# Altium schematic sheet MCU_power.SchDoc
size A4; SheetNumber: 5; SheetTotal: 5
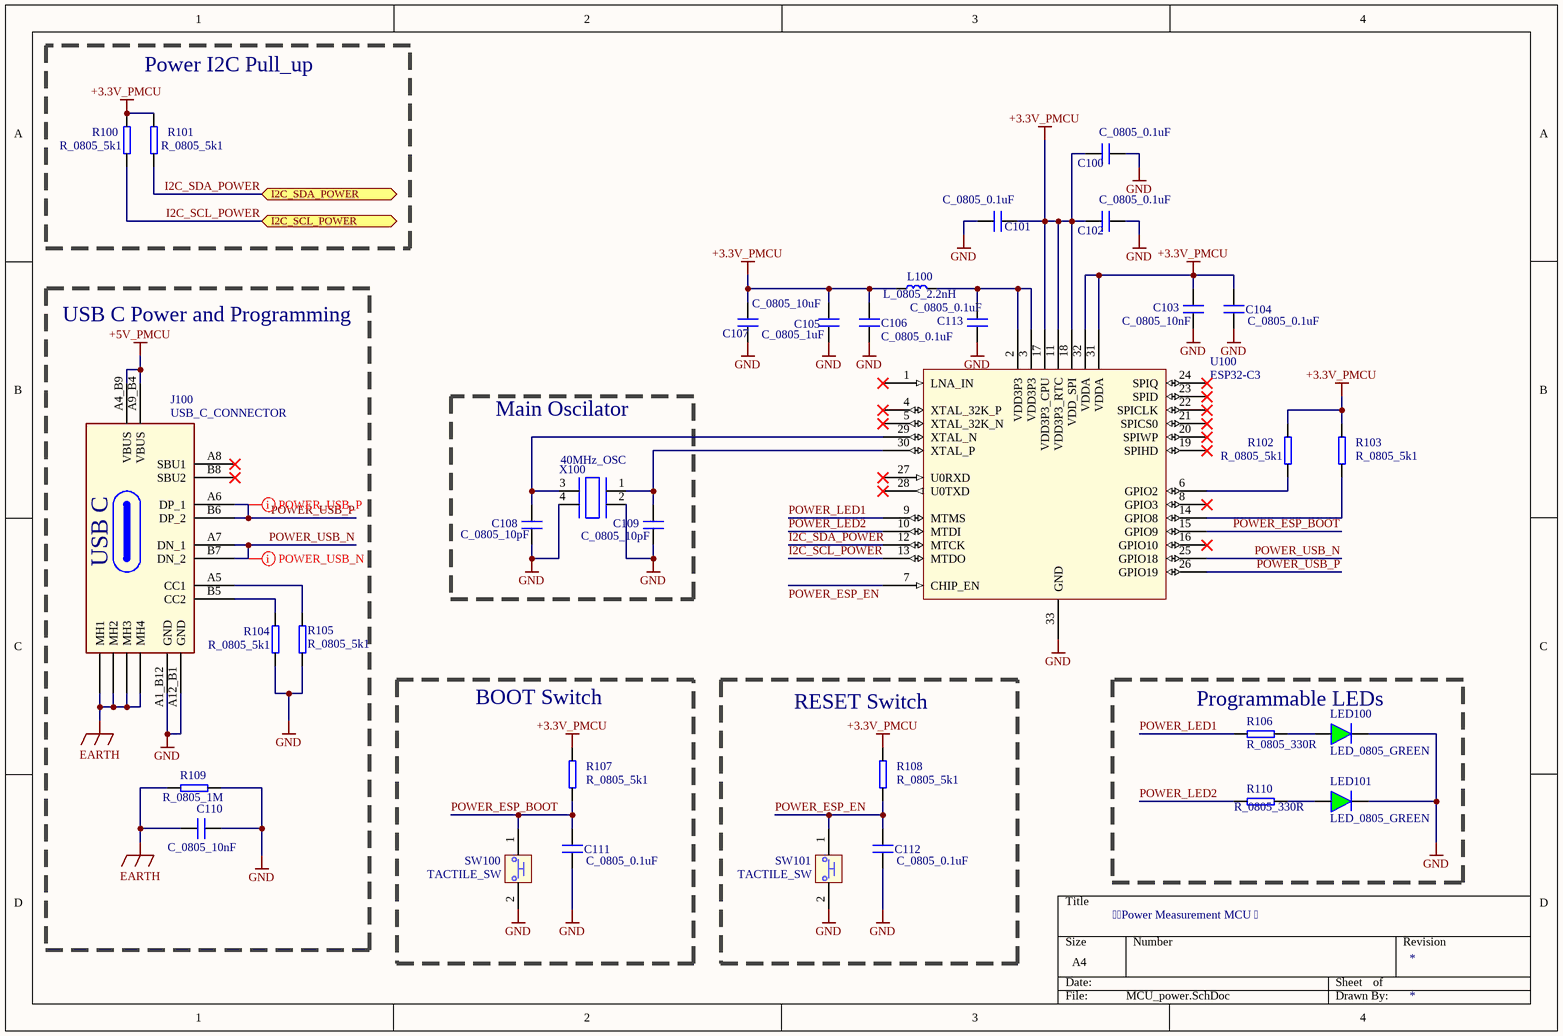
[diagram p0: MCU_power.SchDoc]

## Parts
C100  C_0805_0.1uF  [CAP_0805]
C101  C_0805_0.1uF  [CAP_0805]
C102  C_0805_0.1uF  [CAP_0805]
C103  C_0805_10nF  [CAP_0805]
C104  C_0805_0.1uF  [CAP_0805]
C105  C_0805_1uF  [CAP_0805]
C106  C_0805_0.1uF  [CAP_0805]
C107  C_0805_10uF  [CAP_0805]
C108  C_0805_10pF  [CAP_0805]
C109  C_0805_10pF  [CAP_0805]
C110  C_0805_10nF  [CAP_0805]
C111  C_0805_0.1uF  [CAP_0805]
C112  C_0805_0.1uF  [CAP_0805]
C113  C_0805_0.1uF  [CAP_0805]
J100  USB_C_CONNECTOR  [USB_C_CONNECTOR-Footprint-1]
L100  L_0805_2.2nH  [L_0805]
LED100  LED_0805_GREEN  [LED_0806]
LED101  LED_0805_GREEN  [LED_0806]
R100  R_0805_5k1  [0805_RES]
R101  R_0805_5k1  [0805_RES]
R102  R_0805_5k1  [0805_RES]
R103  R_0805_5k1  [0805_RES]
R104  R_0805_5k1  [0805_RES]
R105  R_0805_5k1  [0805_RES]
R106  R_0805_330R  [0805_RES]
R107  R_0805_5k1  [0805_RES]
R108  R_0805_5k1  [0805_RES]
R109  R_0805_1M  [0805_RES]
R110  R_0805_330R  [0805_RES]
SW100  TACTILE_SW  [TACTILE_SW-Footprint-1]
SW101  TACTILE_SW  [TACTILE_SW-Footprint-1]
U100  ESP32-C3  [QFN127P600-8N]
X100  40MHz_OSC  [40MHz_OSC-Footprint-1]

## Blocks framed on the sheet
Power I2C Pull_up: R100 R101
USB C Power and Programming: C110 J100 R104 R105 R109
Main Oscilator: C108 C109 X100
BOOT Switch: C111 R107 SW100
RESET Switch: C112 R108 SW101
Programmable LEDs: LED100 LED101 R106 R110

## Ports
I2C_SCL_POWER (bidir, see Sensors_Power_Characterisation_Board[2A], PowerSupply[2D]), I2C_SDA_POWER (bidir, see Sensors_Power_Characterisation_Board[2A], PowerSupply[2D])

## Nets
+3.3V_PMCU: C100.1 C101.2 C102.1 C103.2 C104.2 C105.2 C106.1 C107.2 L100.1 R100.1 R101.1 R102.1 R103.1 R107.1 R108.1 U100.11(VDD3P3_RTC) U100.17(VDD3P3_CPU) U100.18(VDD_SPI) U100.31(VDDA) U100.32(VDDA)
+5V_PMCU: J100.A4_B9(VBUS) J100.A9_B4(VBUS)
EARTH: C110.1 J100.MH1 J100.MH2 J100.MH3 J100.MH4 R109.2
GND: C100.2 C101.1 C102.2 C103.1 C104.1 C105.1 C106.2 C107.1 C108.1 C109.1 C110.2 C111.1 C112.1 C113.2 J100.A1_B12(GND) J100.A12_B1(GND) LED100.1 LED101.1 R104.2 R105.2 R109.1 SW100.2 SW101.2 U100.33(GND) X100.2 X100.4
I2C_SCL_POWER: R100.2 U100.13(MTDO) ; port I2C_SCL_POWER
I2C_SDA_POWER: R101.2 U100.12(MTCK) ; port I2C_SDA_POWER
POWER_ESP_BOOT: C111.2 R107.2 SW100.1 U100.15(GPIO9)
POWER_ESP_EN: C112.2 R108.2 SW101.1 U100.7(CHIP_EN)
POWER_LED1: R106.2 U100.9(MTMS)
POWER_LED2: R110.2 U100.10(MTDI)
POWER_USB_N: J100.A7(DN_1) J100.B7(DN_2) U100.25(GPIO18)
POWER_USB_P: J100.A6(DP_1) J100.B6(DP_2) U100.26(GPIO19)
NetC108_2: C108.2 U100.29(XTAL_N) X100.3
NetC109_2: C109.2 U100.30(XTAL_P) X100.1
NetC113_1: C113.1 L100.2 U100.2(VDD3P3) U100.3(VDD3P3)
NetJ100_A5: J100.A5(CC1) R105.1
NetJ100_B5: J100.B5(CC2) R104.1
NetLED100_2: LED100.2 R106.1
NetLED101_2: LED101.2 R110.1
NetR102_2: R102.2 U100.6(GPIO2)
NetR103_2: R103.2 U100.14(GPIO8)

Not connected (* = marked no-connect by the designer): J100 A8(SBU1)* B8(SBU2)*; U100 1(LNA_IN)* 4(XTAL_32K_P)* 5(XTAL_32K_N)* 8(GPIO3)* 16(GPIO10)* 19(SPIHD)* 20(SPIWP)* 21(SPICS0)* 22(SPICLK)* 23(SPID)* 24(SPIQ)* 27(U0RXD)* 28(U0TXD)*

## Layout directives
differential pair: POWER_USB_N, POWER_USB_P

## Notes on the sheet
- Power Measurement MCU 
- (in symbol CMP-00013-4) USB C

## Library data of the parts
C100-C102 C104 C106 C111-C113 = CMP-00002-3: JLC Part Number: C28233
C103 C110 = CMP-00012-2: JLC Part Number: C1710
C105 = CMP-00004-3: JLC Part Number: C28323
C107 = CMP-00006-2: JLC Part Number: C15850
C108 C109 = CMP-00016-3: JLC Part Number: C107107
J100 = CMP-00013-4: USB2.0, Type C, Top Mount, Ch 1.68MM, Dual Row SMT / Tap/rl; Order Code: 538-217179-0001; JLC Part Number: C2831450; Distributor: Mouser
L100 = CMP-00011-3: Required a minimum current of 500mA and a resonant frequrency of at least 6GHz; JLC Part Number: C964055
LED100 LED101 = CMP-00020-3: LED, Green, SMD, 0805 [2012 Metric], 30 mA, 2 V, 570 nm; Order Code: 2322081; Distributor: Farnell; JLC Part Number: C2297
R100-R105 R107 R108 = CMP-00014-2: JLC Part Number: C27834
R106 R110 = CMP-00022-2: JLC Part Number: C17630
R109 = CMP-00037-3: JLC Part Number: C131391
SW100 SW101 = CMP-00017-2: Keypad Switch, 1 Switches, SPST, Momentary-tactile, 0.05A, 12VDC, 2.94N, Solder Terminal, Surface Mount-straight; JLC Part Number: C455280
U100 = CMP-00008-4: 33 pin ESP32_C3 Microcontroller; JLC Part Number: C2858491
X100 = CMP-00029-2: 40 MHZ Oscillator, 10pF load capacitance; JLC Part Number: C426988